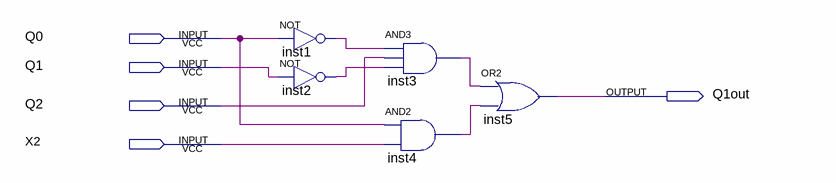
[diagram p0: schematic sheet]
// Quartus schematic P_q1.bdf as structural Verilog: 5 symbols, 5 pins
module P_q1 (
  input  Q0,
  input  Q1,
  input  Q2,
  input  X2,
  output Q1out
);

  wire inst1_out, inst2_out, inst3_out, inst4_out;

  not inst1 (inst1_out, Q0);
  not inst2 (inst2_out, Q1);
  and inst3 (inst3_out, inst1_out, Q2, inst2_out);
  and inst4 (inst4_out, Q0, X2);
  or inst5 (Q1out, inst3_out, inst4_out);
endmodule
